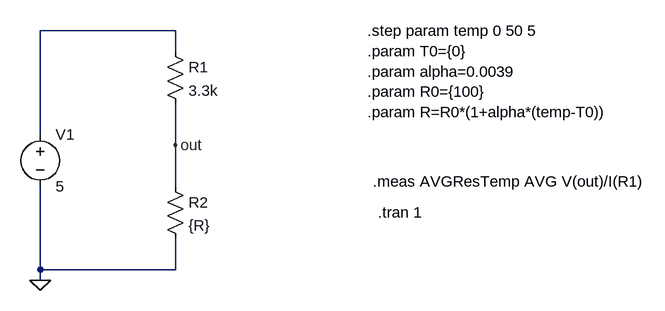
[diagram p0: schematic PT100ohneOPV.asc]
PT100ohneOPV.asc, the LTspice schematic file:
Version 4
SHEET 1 908 680
WIRE 160 -32 -48 -32
WIRE 160 0 160 -32
WIRE -48 128 -48 -32
WIRE 160 144 160 80
WIRE 160 208 160 144
WIRE -48 336 -48 208
WIRE 160 336 160 288
WIRE 160 336 -48 336
WIRE -48 352 -48 336
FLAG -48 352 0
FLAG 160 144 out
SYMBOL voltage -48 112 R0
WINDOW 123 0 0 Left 0
WINDOW 39 0 0 Left 0
SYMATTR InstName V1
SYMATTR Value 5
SYMBOL res 144 -16 R0
SYMATTR InstName R1
SYMATTR Value 3.3k
SYMBOL res 144 192 R0
SYMATTR InstName R2
SYMATTR Value {R}
TEXT 456 -32 Left 2 !.step param temp 0 50 5\n.param T0={0}\n.param alpha=0.0039\n.param R0={100}\n.param R=R0*(1+alpha*(temp-T0))
TEXT 464 200 Left 2 !.meas AVGResTemp AVG V(out)/I(R1)
TEXT 472 248 Left 2 !.tran 1

The netlist it stands for:
* PT100ohneOPV.asc
V1 N001 0 5
R1 N001 out 3.3k
R2 out 0 {R}
.step param temp 0 50 5
.param T0={0}
.param alpha=0.0039
.param R0={100}
.param R=R0*(1+alpha*(temp-T0))
.meas AVGResTemp AVG V(out)/I(R1)
.tran 1
.backanno
.end